# EAGLE design sevenSeg2_atmega_1A_noGND (EAGLE 7.5.0)
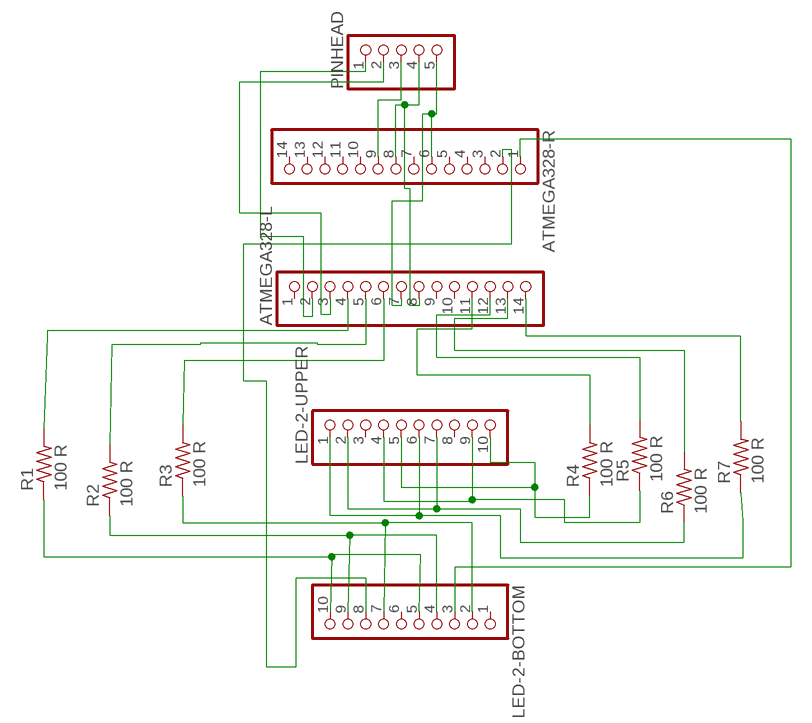
[diagram p0: schematic, sheet 1]

## Parts
ATMEGA328-L  PINHD-1X14  [1X14]
ATMEGA328-R  PINHD-1X14  [1X14]
LED-2-BOTTOM  PINHD-1X10  [1X10]
LED-2-UPPER  PINHD-1X10  [1X10]
PINHEAD  PINHD-1X5  [1X05]
R1  100 R  R-US_0204/7  [0204/7]
R2  100 R  R-US_0204/7  [0204/7]
R3  100 R  R-US_0204/7  [0204/7]
R4  100 R  R-US_0204/7  [0204/7]
R5  100 R  R-US_0204/7  [0204/7]
R6  100 R  R-US_0204/7  [0204/7]
R7  100 R  R-US_0204/7  [0204/7]

## Nets
N$1: ATMEGA328-R.9 PINHEAD.3
N$2: ATMEGA328-L.2 PINHEAD.1
N$3: ATMEGA328-L.3 PINHEAD.2
N$4: ATMEGA328-L.8 ATMEGA328-R.8 PINHEAD.4
N$5: ATMEGA328-L.7 ATMEGA328-R.6 PINHEAD.5
N$7: ATMEGA328-L.4 R1.2
N$8: LED-2-BOTTOM.5 LED-2-BOTTOM.10 R1.1
N$9: ATMEGA328-L.5 R2.2
N$10: LED-2-BOTTOM.4 LED-2-BOTTOM.9 R2.1
N$11: ATMEGA328-L.6 R3.2
N$12: LED-2-BOTTOM.2 LED-2-BOTTOM.7 R3.1
N$13: ATMEGA328-L.11 R4.2
N$14: LED-2-UPPER.5 LED-2-UPPER.10 R4.1
N$15: ATMEGA328-L.12 R5.2
N$16: LED-2-UPPER.4 LED-2-UPPER.9 R5.1
N$17: ATMEGA328-L.13 R6.2
N$18: LED-2-UPPER.2 LED-2-UPPER.7 R6.1
N$19: ATMEGA328-L.14 R7.2
N$20: LED-2-UPPER.1 LED-2-UPPER.6 R7.1
N$21: ATMEGA328-R.2 LED-2-BOTTOM.8
N$22: ATMEGA328-R.1 LED-2-BOTTOM.3
Unconnected: ATMEGA328-L.1 ATMEGA328-L.9 ATMEGA328-L.10 ATMEGA328-R.3 ATMEGA328-R.4 ATMEGA328-R.5 ATMEGA328-R.7 ATMEGA328-R.10 ATMEGA328-R.11 ATMEGA328-R.12 ATMEGA328-R.13 ATMEGA328-R.14 LED-2-BOTTOM.1 LED-2-BOTTOM.6 LED-2-UPPER.3 LED-2-UPPER.8

## Library data of the parts
ATMEGA328-L ATMEGA328-R = pinhead:PINHD-1X14: PIN HEADER
LED-2-BOTTOM LED-2-UPPER = pinhead:PINHD-1X10: PIN HEADER
PINHEAD = pinhead:PINHD-1X5: PIN HEADER
R1-R7 = resistor:R-US_: RESISTOR, American symbol

## Board
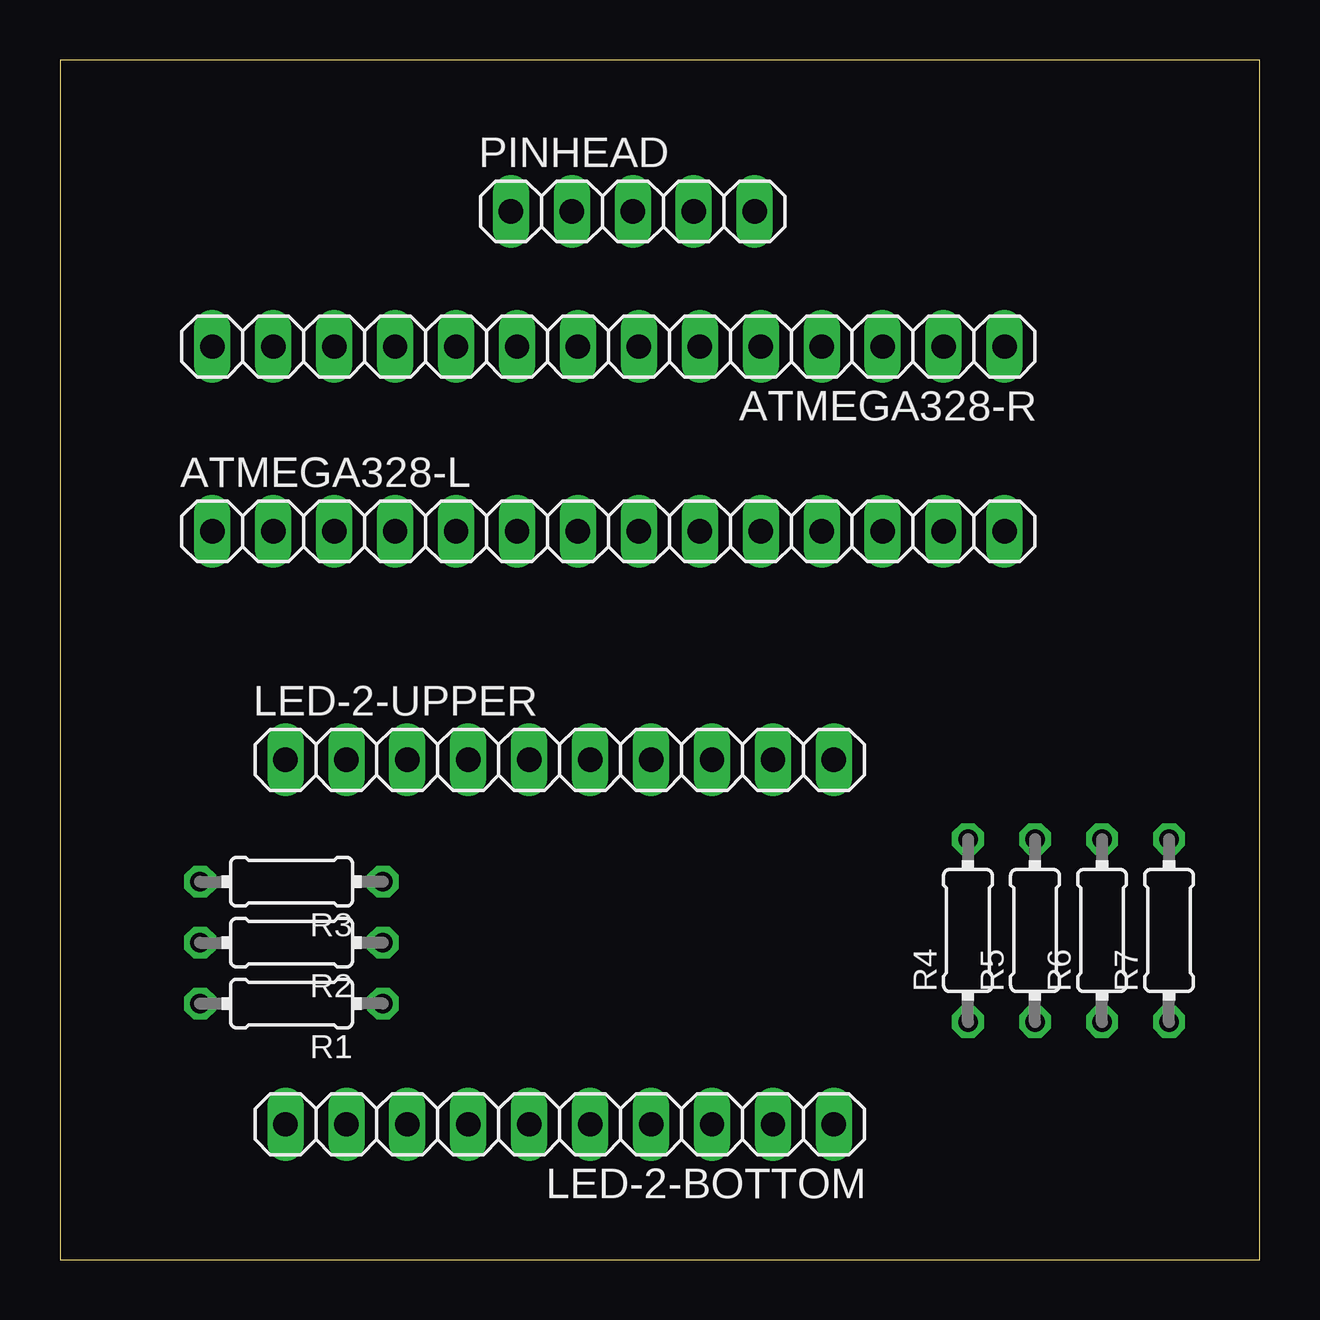
[diagram p1: board, top side]
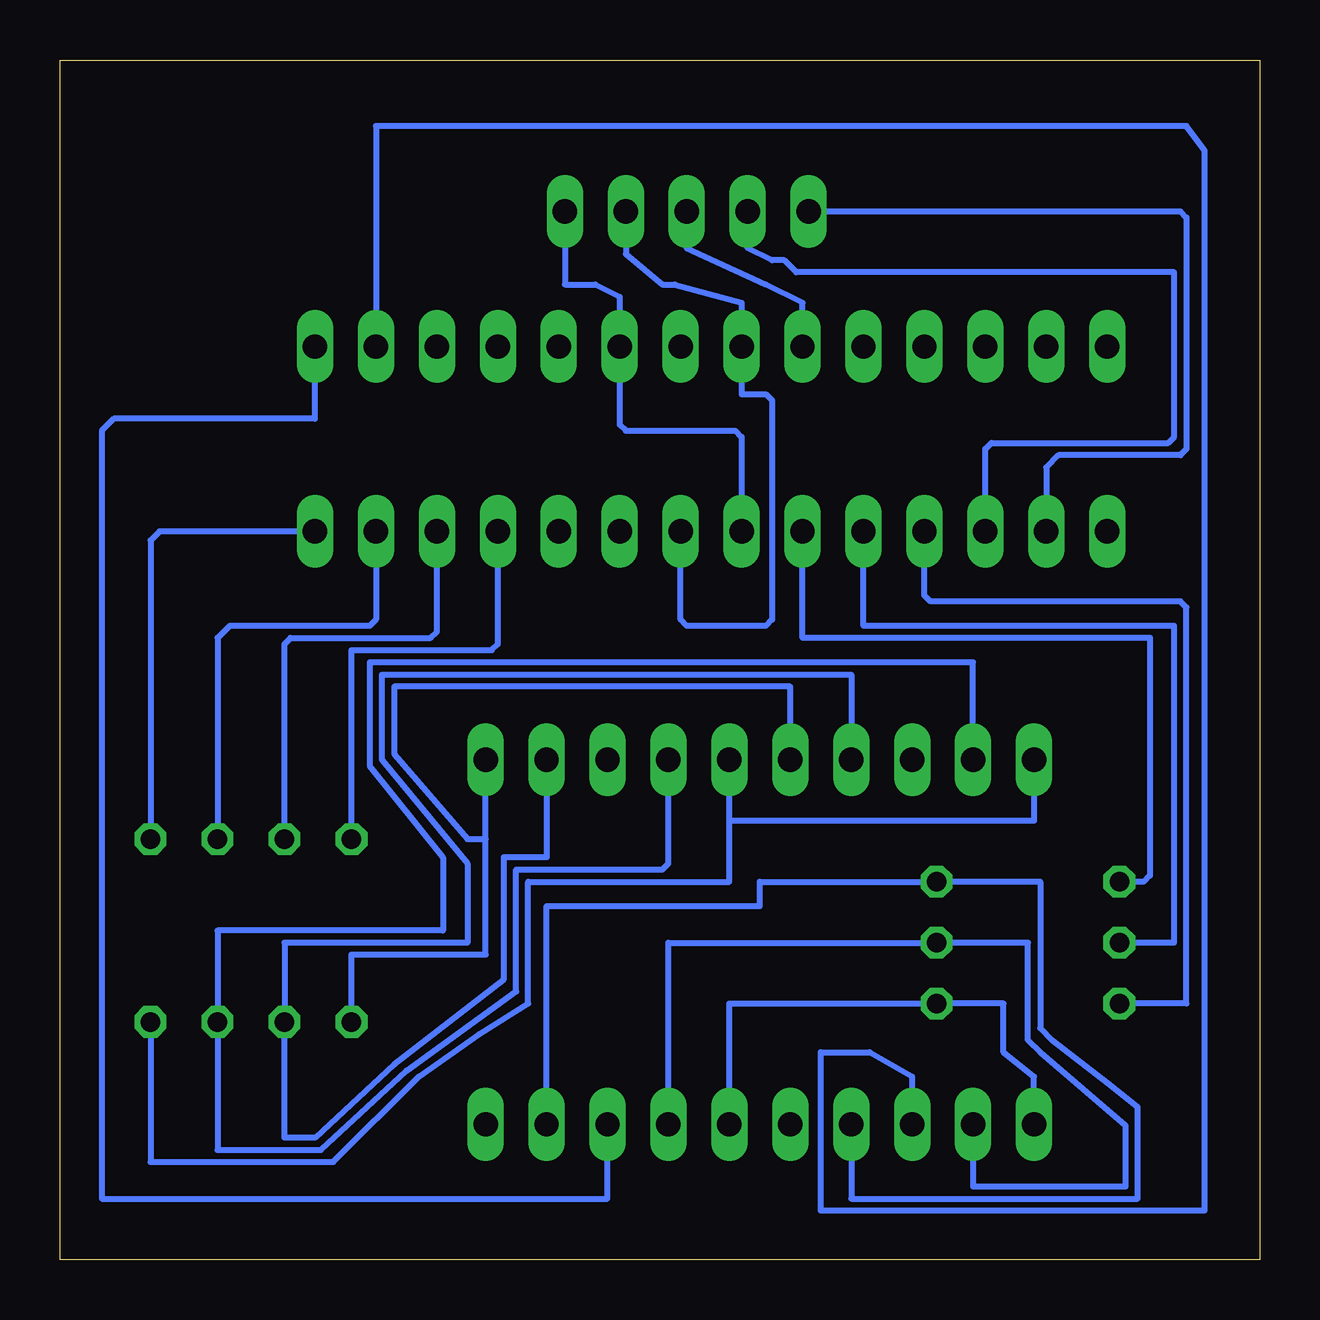
[diagram p2: board, bottom side, seen from below]

Size 50 x 50 mm. Coordinates in mm from the lower left corner, seen from the top.
Outline: 0,0 50,0 50,50 0,50 0,0
Copper layers (1*16): Top 0.035mm / dielectric 1.5mm / Bottom 0.035mm
Design rules "SeeedStudio_2layer_DRU_no_angle_20140221": minimum track width 6mil, minimum drill 12mil, track to track 6mil, track to pad 6mil, pad to pad 6mil, via to via 6mil, smd to smd 0mil, copper to edge 10mil, drill to drill 10mil, minimum pad ring 10mil, minimum via ring 6mil, stop-mask expansion 2mil, vias tented up to drill 100mil, thermal gap 10mil

### Footprints (pad centres in the part's own frame; a part is rotated, then mirrored left to right if it is on the bottom)
1X14 = drill 1.016 long: 1 -16.51,0; 2 -13.97,0; 3 -11.43,0; 4 -8.89,0; 5 -6.35,0; 6 -3.81,0; 7 -1.27,0; 8 1.27,0; 9 3.81,0; 10 6.35,0; 11 8.89,0; 12 11.43,0; 13 13.97,0; 14 16.51,0
1X10 = drill 1.016 long: 1 -11.43,0; 2 -8.89,0; 3 -6.35,0; 4 -3.81,0; 5 -1.27,0; 6 1.27,0; 7 3.81,0; 8 6.35,0; 9 8.89,0; 10 11.43,0
1X05 = drill 1.016 long: 1 -5.08,0; 2 -2.54,0; 3 0,0; 4 2.54,0; 5 5.08,0
0204/7 = drill 0.813 octagon: 1 -3.81,0; 2 3.81,0

### Placement (x,y rotation side)
ATMEGA328-L  22.86,30.35 0 top
ATMEGA328-R  22.86,38.05 180 top
LED-2-BOTTOM  20.83,5.64 180 top
LED-2-UPPER  20.83,20.83 0 top
PINHEAD  23.88,43.69 0 top
R1  9.65,10.67 180 top
R2  9.65,13.21 180 top
R3  9.65,15.75 180 top
R4  37.85,13.72 90 top
R5  40.64,13.72 90 top
R6  43.43,13.72 90 top
R7  46.23,13.72 90 top

### Tracks (layer width: path | path; a pad name or v marks a point on that pad's centre or on a via)
N$1
  Bottom 0.254: ATMEGA328-R.9 19.05,39.88 20.57,40.64 23.88,42.16 PINHEAD.3
N$2
  Bottom 0.254: PINHEAD.1 3.3,43.69 3.05,43.43 3.05,33.78 3.3,33.53 8.38,33.53 8.89,33.02 ATMEGA328-L.2
N$3
  Bottom 0.254: ATMEGA328-L.3 11.43,33.78 11.18,34.04 3.81,34.04 3.56,34.29 3.56,41.15 19.3,41.15 19.81,41.66 20.32,41.66 21.34,42.16 PINHEAD.2
N$4
  Bottom 0.254: PINHEAD.4 26.42,41.91 24.89,40.64 24.38,40.64 21.59,39.88 ATMEGA328-R.8 21.59,36.07 20.57,36.07 20.32,35.81 20.32,26.67 20.57,26.42 23.88,26.42 24.13,26.67 ATMEGA328-L.8
N$5
  Bottom 0.254: PINHEAD.5 28.96,40.64 27.69,40.64 26.67,40.13 ATMEGA328-R.6 26.67,34.8 26.42,34.54 21.84,34.54 21.59,34.29 ATMEGA328-L.7
N$7
  Bottom 0.254: R1.2 3.05,10.67 3.05,27.18 3.3,27.43 13.72,27.43 13.97,27.69 ATMEGA328-L.4
N$8
  Bottom 0.254: LED-2-BOTTOM.5 22.1,10.67 R1.1 10.67,10.67 10.67,8.64 9.4,7.62 LED-2-BOTTOM.10
N$9
  Bottom 0.254: R2.2 3.56,13.21 3.56,26.42 16.51,26.42 ATMEGA328-L.5
N$10
  Bottom 0.254: LED-2-BOTTOM.9 11.94,3.05 5.59,3.05 5.59,5.59 9.14,8.64 9.65,9.14 9.65,13.21 R2.1 24.64,13.21 LED-2-BOTTOM.4
N$11
  Bottom 0.254: R3.2 4.83,15.75 4.57,16 4.57,25.91 19.05,25.91 ATMEGA328-L.6
N$12
  Bottom 0.254: LED-2-BOTTOM.2 29.72,14.73 20.83,14.73 20.83,15.75 R3.1 9.14,15.75 9.14,9.65 8.64,9.14 6.35,7.37 5.08,6.35 5.08,2.54 17.02,2.54 LED-2-BOTTOM.7
N$13
  Bottom 0.254: R4.2 37.85,25.4 32,25.4 31.75,25.65 ATMEGA328-L.11
N$14
  Bottom 0.254: R4.1 37.85,12.7 32.26,12.7 32.26,17.53 | LED-2-UPPER.5 19.56,23.88 36.07,23.88 36.07,21.08 33.02,17.53 32.26,17.53 | 32.26,17.53 LED-2-UPPER.10
N$15
  Bottom 0.254: R5.2 40.64,25.65 40.39,25.91 34.54,25.91 34.29,26.16 ATMEGA328-L.12
N$16
  Bottom 0.254: LED-2-UPPER.9 29.72,16.76 31.5,16.76 31.5,11.68 36.07,8.13 39.37,5.08 40.64,5.08 R5.1 40.64,13.21 33.02,13.21 33.02,16.51 36.58,20.83 36.58,24.38 17.02,24.38 LED-2-UPPER.4
N$17
  Bottom 0.254: ATMEGA328-L.13 36.83,26.67 37.08,26.42 42.93,26.42 43.43,25.91 R6.2
N$18
  Bottom 0.254: LED-2-UPPER.7 24.64,16.51 24.89,16.26 30.99,16.26 30.99,11.18 35.56,7.87 39.12,4.57 43.43,4.57 R6.1 43.43,13.72 34.04,13.72 34.04,16.76 37.08,20.57 37.08,24.89 11.94,24.89 LED-2-UPPER.2
N$19
  Bottom 0.254: ATMEGA328-L.14 45.85,30.35 46.23,29.97 R7.2
N$20
  Bottom 0.254: R7.1 46.23,4.06 38.61,4.06 35.05,7.62 32.51,9.4 30.48,10.67 30.48,15.75 22.1,15.75 22.1,18.29 | 22.1,18.29 LED-2-UPPER.6 | LED-2-UPPER.1 9.4,18.29 22.1,18.29
N$21
  Bottom 0.254: LED-2-BOTTOM.8 14.48,7.62 16.26,8.64 18.29,8.64 18.29,2.03 2.29,2.03 2.29,46.23 3.05,47.24 36.83,47.24 ATMEGA328-R.2
N$22
  Bottom 0.254: LED-2-BOTTOM.3 27.18,2.54 48.26,2.54 48.26,34.54 47.75,35.05 39.37,35.05 ATMEGA328-R.1